# Altium schematic sheet power.SchDoc
size A4
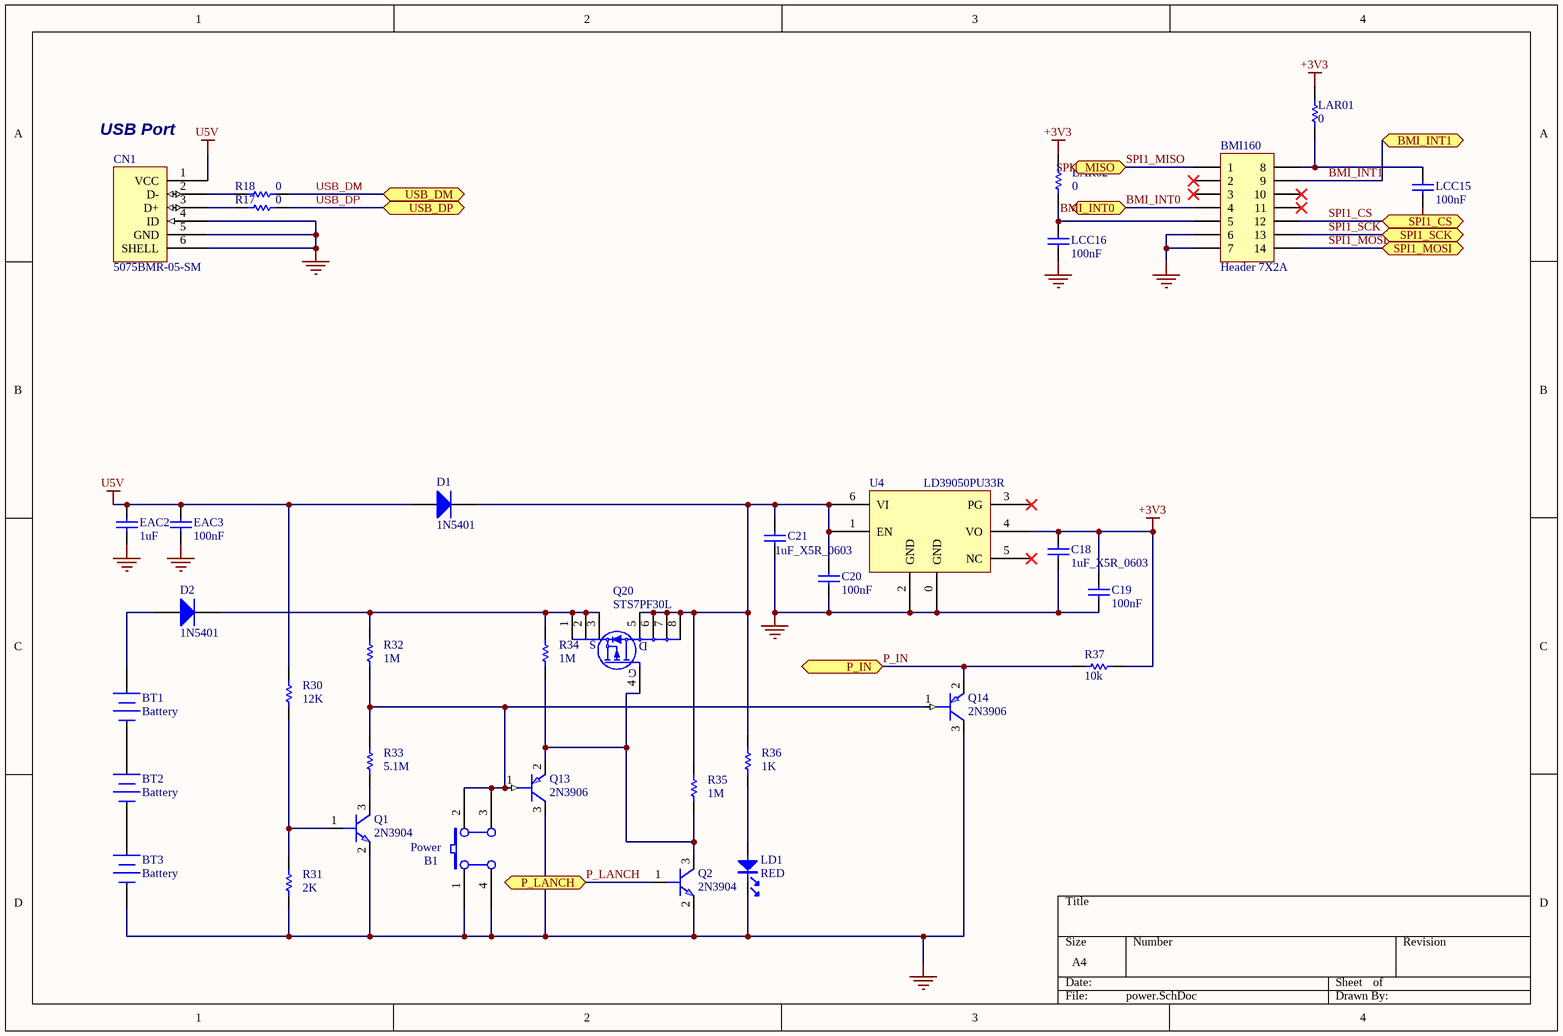
[diagram p0: power.SchDoc]

## Parts
B1  Power  [PB10]
BMI160  Header 7X2A  [BMI160]
BT1  Battery  [BAT]
BT2  Battery  [BAT]
BT3  Battery  [BAT]
C18  1uF_X5R_0603  [0603C]
C19  100nF  [0603C]
C20  100nF  [0603C]
C21  1uF_X5R_0603  [0603C]
CN1  5075BMR-05-SM  [USB-MINI-B-SMD]
D1  1N5401  [SMA]
D2  1N5401  [SMA]
EAC2  1uF  [0603C]
EAC3  100nF  [0603C]
LAR01  0  [0603R]
LAR02  0  [0603R]
LCC15  100nF  [0603C]
LCC16  100nF  [0603C]
LD1  RED  [0603D]
Q1  2N3904  [SOT-23]
Q2  2N3904  [SOT-23]
Q13  2N3906  [SOT-23]
Q14  2N3906  [SOT-23]
Q20  STS7PF30L  [SO8]
R17  0  [0603R]
R18  0  [0603R]
R30  12K  [0603R]
R31  2K  [0603R]
R32  1M  [0603R]
R33  5.1M  [0603R]
R34  1M  [0603R]
R35  1M  [0603R]
R36  1K  [0603R]
R37  10k  [0603R]
U4  LD39050PU33R  [DFN6(3X3)]

## Ports
BMI_INT0 (bidir), BMI_INT1 (bidir), P_IN (bidir), P_LANCH, SPI1_CS (bidir), SPI1_MISO (bidir), SPI1_MOSI (bidir), SPI1_SCK (bidir), USB_DM (bidir), USB_DP (bidir)

## Nets
+3V3: C18.1 C19.2 LAR01.2 LAR02.2 R37.1 U4.4(VO)
GND: B1.1(A0) B1.4(A1) BMI160.6 BMI160.7 BT3.2(-) C18.2 C19.1 C20.1 C21.2 CN1.4(ID) CN1.5(GND) CN1.6(SHELL) EAC2.2 EAC3.2 LCC15.1 LCC16.1 LD1.2 Q1.2(E) Q2.2(E) Q13.3(COLLECTOR) Q14.3(COLLECTOR) R31.1 U4.0(GND) U4.2(GND)
U5V: CN1.1(VCC) D1.1(A) EAC2.1 EAC3.1 R30.2
BMI_INT0: BMI160.4 ; port BMI_INT0
BMI_INT1: BMI160.9 ; port BMI_INT1
P_IN: Q14.2(EMITTER) R37.2 ; port P_IN
P_LANCH: Q2.1(B) ; port P_LANCH
SPI1_CS: BMI160.12 ; port SPI1_CS
SPI1_MISO: BMI160.1 ; port SPI1_MISO
SPI1_MOSI: BMI160.14 ; port SPI1_MOSI
SPI1_SCK: BMI160.13 ; port SPI1_SCK
USB_DM: R18.2 ; port USB_DM
USB_DP: R17.2 ; port USB_DP
NetB1_2: B1.2(B0) B1.3(B1) Q13.1(BASE) Q14.1(BASE) R32.1 R33.2
NetBMI160_5: BMI160.5 LAR02.1 LCC16.2
NetBMI160_8: BMI160.8 LAR01.1 LCC15.2
NetBT1_1: BT1.1(+) D2.1(A)
NetBT1_2: BT1.2(-) BT2.1(+)
NetBT2_2: BT2.2(-) BT3.1(+)
NetC20_2: C20.2 C21.1 D1.2(K) Q20.5(D) Q20.6(D) Q20.7(D) Q20.8(D) R35.2 R36.2 U4.1(EN) U4.6(VI)
NetCN1_2: CN1.2(D-) R18.1
NetCN1_3: CN1.3(D+) R17.1
NetD2_2: D2.2(K) Q20.1(S) Q20.2(S) Q20.3(S) R32.2 R34.2
NetLD1_1: LD1.1 R36.1
NetQ1_1: Q1.1(B) R30.1 R31.2
NetQ1_3: Q1.3(C) R33.1
NetQ2_3: Q2.3(C) Q13.2(EMITTER) Q20.4(G) R34.1 R35.1

Not connected (* = marked no-connect by the designer): BMI160 2* 3* 10* 11*; U4 3(PG)* 5(NC)*

## Notes on the sheet
- (near CN1) USB Port

## Library data of the parts
B1 = SW PUSHBUTTON: SE PUSHBUTTON
BMI160 = Header 7X2A: Header, 7-Pin, Dual row; LatestRevisionDate: 17-Jul-2002; LatestRevisionNote: Re-released for DXP Platform.; Publisher: Altium Limited
BT1-BT3 = Battery: Multicell Battery; Published: 24-Mar-1999; LatestRevisionDate: 17-Jul-2002; LatestRevisionNote: Re-released for DXP Platform.; PackageReference: BAT-2; Publisher: Altium Limited; PackageDescription: Battery; 2 Leads
C18 C21 = CAP SMD 0603  X5R 1礔 25V 10%: 0603  X5R 1礔; Rated voltage: 25V; Tolerance: 10%; Manufacturer: *; Manufacturer P/N: *; Order code Farnell: 1288202RL; Value: 1礔; Power: *; Technology: X5R; Temperature  Factor: *; Temperature Max: +125癈; Temperature Min: -55癈; STS Code: *
C19 C20 = Capacitor_ST: Capacitor 0402 / 0603 / 0805; Revision: July-2002: Re-released for DXP Platform.; Value: 100nF
CN1 = USB-MINI-typeB connector: Manuf_Part_1: 5075BMR-05-SM; Order: 5075BMR-05-SM; ECCN: ????
D1 D2 = STPS2L30A: Manuf_1: STM; Provided: ST; Order: BAT60JFILM; ECCN_US/EU: EAR99/NEC; Revision: July-2002: Re-released for DXP Platform.; Manuf_Part_1: BAT60JFILM; Distrib: ST
EAC2 EAC3 LCC15 LCC16 = CAP: Capacitor; Value: 100pF; Published: 8-Jun-2000; Revision: July-2002: Re-released for DXP Platform.; Publisher: Altium Limited
LAR01 LAR02 = res1: Resistor; Value: 1K; Published: 8-Jun-2000; Revision: July-2002: Re-released for DXP Platform.; Publisher: Altium Limited
LD1 = PHOTO
Q1 Q2 = 2N5551: Text Field1: 20; Text Field2: 20
Q13 Q14 = 2N5401: Text Field1: 20; Text Field2: 20
R17 R18 R30-R36 = Resistor_ST: Resistor 0402 / 0603 / 0805; Value: 10K
R37 = Resistor_ST: Resistor 0402 / 0603 / 0805; Value: 10K
U4 = LD39050P